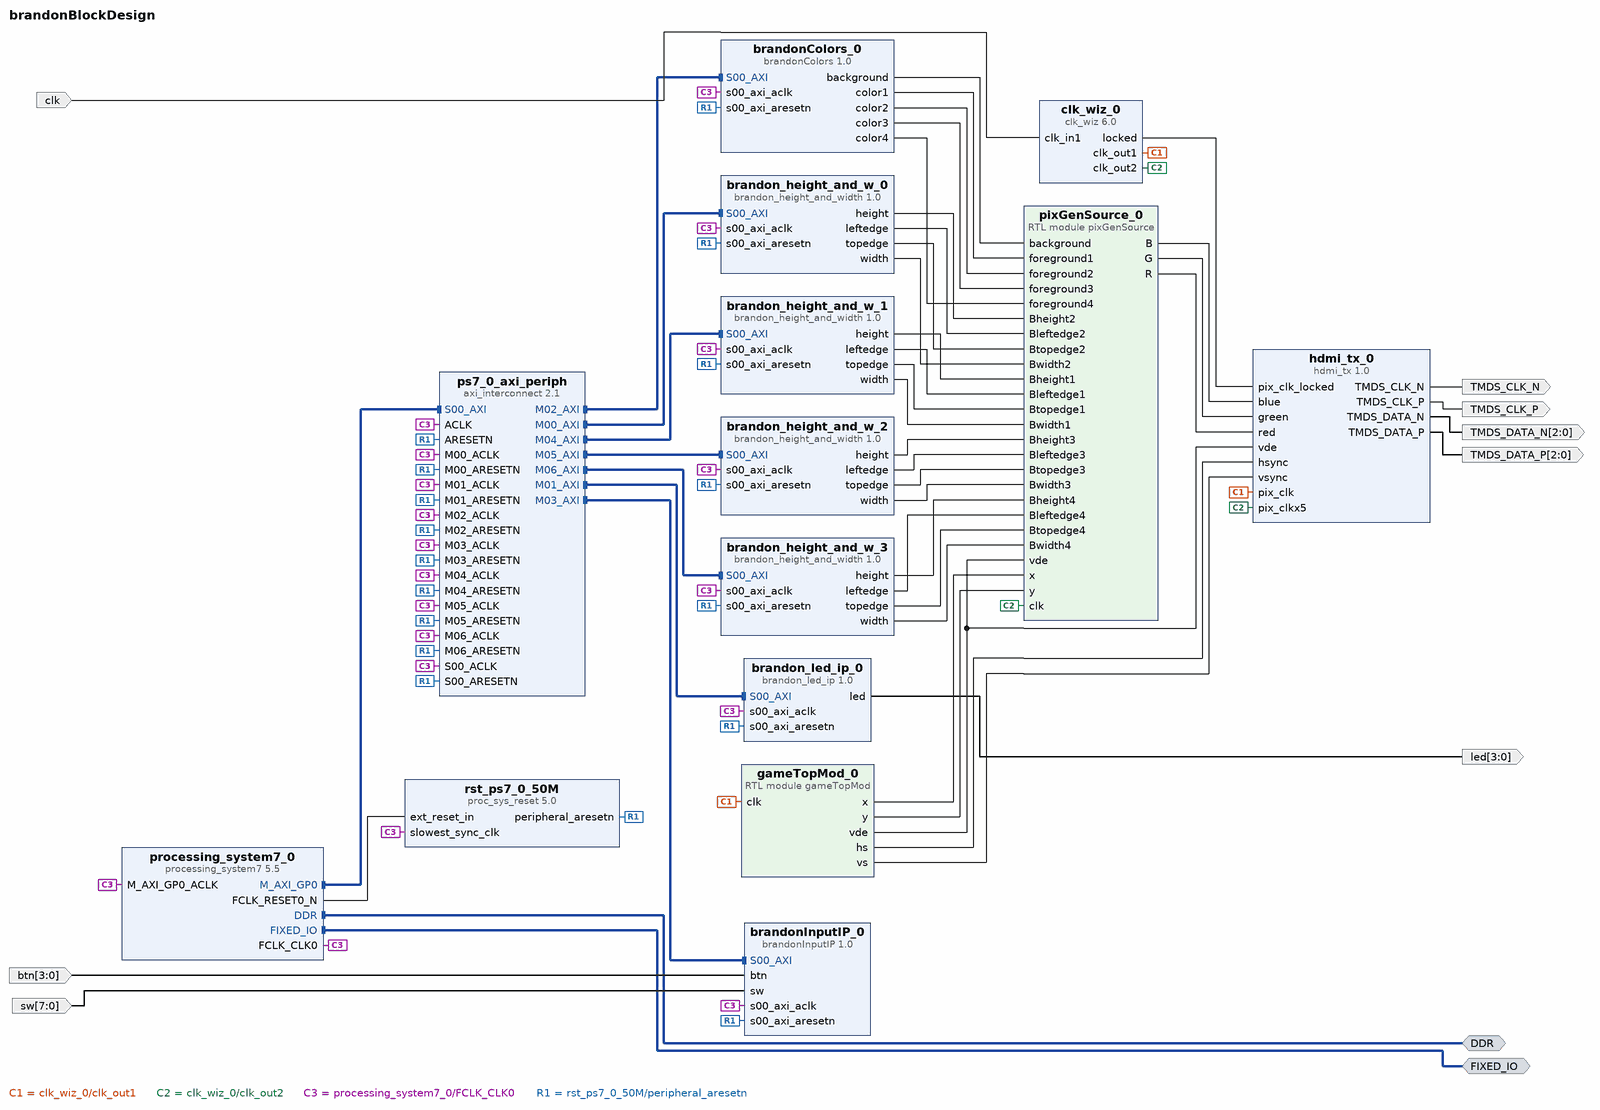
[diagram p0: block diagram of the top level]
# Vivado block design brandonBlockDesign, xc7z007sclg400-1, Vivado 2021.1
create_bd_design brandonBlockDesign

create_bd_intf_port -mode Master -vlnv xilinx.com:interface:ddrx_rtl:1.0 DDR
create_bd_intf_port -mode Master -vlnv xilinx.com:display_processing_system7:fixedio_rtl:1.0 FIXED_IO
create_bd_port -dir I -from 7 -to 0 sw
create_bd_port -dir I -from 3 -to 0 btn
create_bd_port -dir O -from 3 -to 0 led
create_bd_port -dir O -type clk TMDS_CLK_P
create_bd_port -dir O -from 2 -to 0 TMDS_DATA_N
create_bd_port -dir O -type clk TMDS_CLK_N
create_bd_port -dir O -from 2 -to 0 TMDS_DATA_P
create_bd_port -dir I -type clk clk

create_bd_cell -type ip -vlnv xilinx.com:ip:processing_system7:5.5 processing_system7_0
set_property -dict [list \
  CONFIG.PCW_FPGA0_PERIPHERAL_FREQMHZ 50 \
  CONFIG.PCW_GPIO_MIO_GPIO_ENABLE 1 \
  CONFIG.PCW_GPIO_MIO_GPIO_IO MIO \
  CONFIG.PCW_I2C_RESET_ENABLE 1 \
  CONFIG.PCW_QSPI_GRP_FBCLK_ENABLE 1 \
  CONFIG.PCW_QSPI_GRP_FBCLK_IO {MIO 8} \
  CONFIG.PCW_QSPI_GRP_SINGLE_SS_ENABLE 1 \
  CONFIG.PCW_QSPI_GRP_SINGLE_SS_IO {MIO 1 .. 6} \
  CONFIG.PCW_QSPI_PERIPHERAL_ENABLE 1 \
  CONFIG.PCW_QSPI_QSPI_IO {MIO 1 .. 6} \
  CONFIG.PCW_SD0_GRP_CD_ENABLE 1 \
  CONFIG.PCW_SD0_GRP_CD_IO {MIO 47} \
  CONFIG.PCW_SD0_GRP_WP_ENABLE 0 \
  CONFIG.PCW_SD0_PERIPHERAL_ENABLE 1 \
  CONFIG.PCW_SD0_SD0_IO {MIO 40 .. 45} \
  CONFIG.PCW_SDIO_PERIPHERAL_FREQMHZ 100 \
  CONFIG.PCW_SINGLE_QSPI_DATA_MODE x4 \
  CONFIG.PCW_SPI1_PERIPHERAL_ENABLE 1 \
  CONFIG.PCW_SPI1_SPI1_IO {MIO 10 .. 15} \
  CONFIG.PCW_UART0_PERIPHERAL_ENABLE 1 \
  CONFIG.PCW_UART0_UART0_IO {MIO 14 .. 15} \
  CONFIG.PCW_UART1_PERIPHERAL_ENABLE 0 \
  CONFIG.PCW_UART_PERIPHERAL_FREQMHZ 100 \
  CONFIG.PCW_UIPARAM_DDR_BUS_WIDTH {16 Bit} \
  CONFIG.PCW_UIPARAM_DDR_MEMORY_TYPE {DDR 3 (Low Voltage)} \
  CONFIG.PCW_UIPARAM_DDR_PARTNO Custom \
  CONFIG.PCW_USB0_PERIPHERAL_ENABLE 1 \
  CONFIG.PCW_USB0_RESET_ENABLE 1 \
  CONFIG.PCW_USB0_RESET_IO {MIO 46} \
  CONFIG.PCW_USB0_USB0_IO {MIO 28 .. 39} \
  CONFIG.PCW_USB_RESET_ENABLE 1 \
  CONFIG.PCW_USB_RESET_SELECT {Share reset pin} \
] [get_bd_cells processing_system7_0]
# 222 more settings of processing_system7_0 are not shown: defaults, MIO pin electricals, DDR timing, and values the tool derives
create_bd_cell -type ip -vlnv xilinx.com:user:brandon_led_ip:1.0 brandon_led_ip_0
create_bd_cell -type ip -vlnv xilinx.com:ip:proc_sys_reset:5.0 rst_ps7_0_50M
create_bd_cell -type ip -vlnv xilinx.com:user:brandonInputIP:1.0 brandonInputIP_0
create_bd_cell -type ip -vlnv realdigital.org:realdigital:hdmi_tx:1.0 hdmi_tx_0
create_bd_cell -type ip -vlnv xilinx.com:ip:clk_wiz:6.0 clk_wiz_0
set_property -dict [list \
  CONFIG.CLKOUT1_JITTER 337.616 \
  CONFIG.CLKOUT1_PHASE_ERROR 322.999 \
  CONFIG.CLKOUT1_REQUESTED_OUT_FREQ 74.25 \
  CONFIG.CLKOUT2_JITTER 258.703 \
  CONFIG.CLKOUT2_PHASE_ERROR 322.999 \
  CONFIG.CLKOUT2_REQUESTED_OUT_FREQ 371.25 \
  CONFIG.CLKOUT2_USED true \
  CONFIG.MMCM_CLKFBOUT_MULT_F 37.125 \
  CONFIG.MMCM_CLKOUT0_DIVIDE_F 10.000 \
  CONFIG.MMCM_CLKOUT1_DIVIDE 2 \
  CONFIG.MMCM_DIVCLK_DIVIDE 5 \
  CONFIG.NUM_OUT_CLKS 2 \
  CONFIG.USE_RESET false \
] [get_bd_cells clk_wiz_0]
create_bd_cell -type ip -vlnv xilinx.com:user:brandon_height_and_width:1.0 brandon_height_and_w_0
create_bd_cell -type ip -vlnv wsu.edu:user:brandonColors:1.0 brandonColors_0
create_bd_cell -type module -reference gameTopMod gameTopMod_0
create_bd_cell -type ip -vlnv xilinx.com:ip:axi_interconnect:2.1 ps7_0_axi_periph
set_property -dict {CONFIG.NUM_MI 7} [get_bd_cells ps7_0_axi_periph]
create_bd_cell -type ip -vlnv xilinx.com:user:brandon_height_and_width:1.0 brandon_height_and_w_1
create_bd_cell -type ip -vlnv xilinx.com:user:brandon_height_and_width:1.0 brandon_height_and_w_2
create_bd_cell -type ip -vlnv xilinx.com:user:brandon_height_and_width:1.0 brandon_height_and_w_3
create_bd_cell -type module -reference pixGenSource pixGenSource_0

# ---- connections ----

connect_bd_intf_net [get_bd_intf_ports DDR] [get_bd_intf_pins processing_system7_0/DDR]
connect_bd_intf_net [get_bd_intf_ports FIXED_IO] [get_bd_intf_pins processing_system7_0/FIXED_IO]
connect_bd_intf_net [get_bd_intf_pins processing_system7_0/M_AXI_GP0] [get_bd_intf_pins ps7_0_axi_periph/S00_AXI]
connect_bd_intf_net [get_bd_intf_pins ps7_0_axi_periph/M00_AXI] [get_bd_intf_pins brandon_height_and_w_0/S00_AXI]
connect_bd_intf_net [get_bd_intf_pins ps7_0_axi_periph/M01_AXI] [get_bd_intf_pins brandon_led_ip_0/S00_AXI]
connect_bd_intf_net [get_bd_intf_pins ps7_0_axi_periph/M02_AXI] [get_bd_intf_pins brandonColors_0/S00_AXI]
connect_bd_intf_net [get_bd_intf_pins ps7_0_axi_periph/M03_AXI] [get_bd_intf_pins brandonInputIP_0/S00_AXI]
connect_bd_intf_net [get_bd_intf_pins ps7_0_axi_periph/M04_AXI] [get_bd_intf_pins brandon_height_and_w_1/S00_AXI]
connect_bd_intf_net [get_bd_intf_pins ps7_0_axi_periph/M05_AXI] [get_bd_intf_pins brandon_height_and_w_2/S00_AXI]
connect_bd_intf_net [get_bd_intf_pins ps7_0_axi_periph/M06_AXI] [get_bd_intf_pins brandon_height_and_w_3/S00_AXI]
connect_bd_net [get_bd_pins brandonColors_0/background] [get_bd_pins pixGenSource_0/background]
connect_bd_net [get_bd_pins brandonColors_0/color1] [get_bd_pins pixGenSource_0/foreground1]
connect_bd_net [get_bd_pins brandonColors_0/color2] [get_bd_pins pixGenSource_0/foreground2]
connect_bd_net [get_bd_pins brandonColors_0/color3] [get_bd_pins pixGenSource_0/foreground3]
connect_bd_net [get_bd_pins brandonColors_0/color4] [get_bd_pins pixGenSource_0/foreground4]
connect_bd_net [get_bd_pins brandon_height_and_w_0/height] [get_bd_pins pixGenSource_0/Bheight2]
connect_bd_net [get_bd_pins brandon_height_and_w_0/leftedge] [get_bd_pins pixGenSource_0/Bleftedge2]
connect_bd_net [get_bd_pins brandon_height_and_w_0/topedge] [get_bd_pins pixGenSource_0/Btopedge2]
connect_bd_net [get_bd_pins brandon_height_and_w_0/width] [get_bd_pins pixGenSource_0/Bwidth2]
connect_bd_net [get_bd_pins brandon_height_and_w_1/height] [get_bd_pins pixGenSource_0/Bheight1]
connect_bd_net [get_bd_pins brandon_height_and_w_1/leftedge] [get_bd_pins pixGenSource_0/Bleftedge1]
connect_bd_net [get_bd_pins brandon_height_and_w_1/topedge] [get_bd_pins pixGenSource_0/Btopedge1]
connect_bd_net [get_bd_pins brandon_height_and_w_1/width] [get_bd_pins pixGenSource_0/Bwidth1]
connect_bd_net [get_bd_pins brandon_height_and_w_2/height] [get_bd_pins pixGenSource_0/Bheight3]
connect_bd_net [get_bd_pins brandon_height_and_w_2/leftedge] [get_bd_pins pixGenSource_0/Bleftedge3]
connect_bd_net [get_bd_pins brandon_height_and_w_2/topedge] [get_bd_pins pixGenSource_0/Btopedge3]
connect_bd_net [get_bd_pins brandon_height_and_w_2/width] [get_bd_pins pixGenSource_0/Bwidth3]
connect_bd_net [get_bd_pins brandon_height_and_w_3/height] [get_bd_pins pixGenSource_0/Bheight4]
connect_bd_net [get_bd_pins brandon_height_and_w_3/leftedge] [get_bd_pins pixGenSource_0/Bleftedge4]
connect_bd_net [get_bd_pins brandon_height_and_w_3/topedge] [get_bd_pins pixGenSource_0/Btopedge4]
connect_bd_net [get_bd_pins brandon_height_and_w_3/width] [get_bd_pins pixGenSource_0/Bwidth4]
connect_bd_net [get_bd_pins brandon_led_ip_0/led] [get_bd_ports led]
connect_bd_net -net btn_0_1 [get_bd_ports btn] [get_bd_pins brandonInputIP_0/btn]
connect_bd_net [get_bd_ports clk] [get_bd_pins clk_wiz_0/clk_in1]
connect_bd_net [get_bd_pins clk_wiz_0/clk_out1] [get_bd_pins hdmi_tx_0/pix_clk] [get_bd_pins gameTopMod_0/clk]
connect_bd_net [get_bd_pins clk_wiz_0/clk_out2] [get_bd_pins hdmi_tx_0/pix_clkx5] [get_bd_pins pixGenSource_0/clk]
connect_bd_net [get_bd_pins clk_wiz_0/locked] [get_bd_pins hdmi_tx_0/pix_clk_locked]
connect_bd_net [get_bd_pins gameTopMod_0/hs] [get_bd_pins hdmi_tx_0/hsync]
connect_bd_net [get_bd_pins gameTopMod_0/vde] [get_bd_pins pixGenSource_0/vde] [get_bd_pins hdmi_tx_0/vde]
connect_bd_net [get_bd_pins gameTopMod_0/vs] [get_bd_pins hdmi_tx_0/vsync]
connect_bd_net [get_bd_pins gameTopMod_0/x] [get_bd_pins pixGenSource_0/x]
connect_bd_net [get_bd_pins gameTopMod_0/y] [get_bd_pins pixGenSource_0/y]
connect_bd_net [get_bd_pins hdmi_tx_0/TMDS_CLK_N] [get_bd_ports TMDS_CLK_N]
connect_bd_net [get_bd_pins hdmi_tx_0/TMDS_CLK_P] [get_bd_ports TMDS_CLK_P]
connect_bd_net [get_bd_pins hdmi_tx_0/TMDS_DATA_N] [get_bd_ports TMDS_DATA_N]
connect_bd_net [get_bd_pins hdmi_tx_0/TMDS_DATA_P] [get_bd_ports TMDS_DATA_P]
connect_bd_net [get_bd_pins pixGenSource_0/B] [get_bd_pins hdmi_tx_0/blue]
connect_bd_net [get_bd_pins pixGenSource_0/G] [get_bd_pins hdmi_tx_0/green]
connect_bd_net [get_bd_pins pixGenSource_0/R] [get_bd_pins hdmi_tx_0/red]
connect_bd_net [get_bd_pins processing_system7_0/FCLK_CLK0] \
  [get_bd_pins brandon_height_and_w_0/s00_axi_aclk] [get_bd_pins brandon_led_ip_0/s00_axi_aclk] \
  [get_bd_pins brandonColors_0/s00_axi_aclk] [get_bd_pins brandonInputIP_0/s00_axi_aclk] \
  [get_bd_pins processing_system7_0/M_AXI_GP0_ACLK] [get_bd_pins rst_ps7_0_50M/slowest_sync_clk] \
  [get_bd_pins ps7_0_axi_periph/ACLK] [get_bd_pins ps7_0_axi_periph/S00_ACLK] [get_bd_pins ps7_0_axi_periph/M00_ACLK] \
  [get_bd_pins ps7_0_axi_periph/M01_ACLK] [get_bd_pins ps7_0_axi_periph/M02_ACLK] [get_bd_pins ps7_0_axi_periph/M03_ACLK] \
  [get_bd_pins brandon_height_and_w_1/s00_axi_aclk] [get_bd_pins ps7_0_axi_periph/M04_ACLK] \
  [get_bd_pins brandon_height_and_w_2/s00_axi_aclk] [get_bd_pins ps7_0_axi_periph/M05_ACLK] \
  [get_bd_pins brandon_height_and_w_3/s00_axi_aclk] [get_bd_pins ps7_0_axi_periph/M06_ACLK]
connect_bd_net [get_bd_pins processing_system7_0/FCLK_RESET0_N] [get_bd_pins rst_ps7_0_50M/ext_reset_in]
connect_bd_net [get_bd_pins rst_ps7_0_50M/peripheral_aresetn] \
  [get_bd_pins brandon_led_ip_0/s00_axi_aresetn] [get_bd_pins brandonInputIP_0/s00_axi_aresetn] \
  [get_bd_pins brandon_height_and_w_0/s00_axi_aresetn] [get_bd_pins brandonColors_0/s00_axi_aresetn] \
  [get_bd_pins ps7_0_axi_periph/S00_ARESETN] [get_bd_pins ps7_0_axi_periph/M00_ARESETN] \
  [get_bd_pins ps7_0_axi_periph/ARESETN] [get_bd_pins ps7_0_axi_periph/M01_ARESETN] \
  [get_bd_pins ps7_0_axi_periph/M02_ARESETN] [get_bd_pins ps7_0_axi_periph/M03_ARESETN] \
  [get_bd_pins brandon_height_and_w_1/s00_axi_aresetn] [get_bd_pins ps7_0_axi_periph/M04_ARESETN] \
  [get_bd_pins brandon_height_and_w_2/s00_axi_aresetn] [get_bd_pins ps7_0_axi_periph/M05_ARESETN] \
  [get_bd_pins brandon_height_and_w_3/s00_axi_aresetn] [get_bd_pins ps7_0_axi_periph/M06_ARESETN]
connect_bd_net -net sw_0_1 [get_bd_ports sw] [get_bd_pins brandonInputIP_0/sw]

# ---- address map ----
assign_bd_address -offset 0x43C00000 -range 64K -target_address_space [get_bd_addr_spaces processing_system7_0/Data] [get_bd_addr_segs brandon_height_and_w_0/S00_AXI/S00_AXI_reg]
assign_bd_address -offset 0x43C10000 -range 64K -target_address_space [get_bd_addr_spaces processing_system7_0/Data] [get_bd_addr_segs brandon_led_ip_0/S00_AXI/S00_AXI_reg]
assign_bd_address -offset 0x43C20000 -range 64K -target_address_space [get_bd_addr_spaces processing_system7_0/Data] [get_bd_addr_segs brandonInputIP_0/S00_AXI/S00_AXI_reg]
assign_bd_address -offset 0x43C30000 -range 64K -target_address_space [get_bd_addr_spaces processing_system7_0/Data] [get_bd_addr_segs brandonColors_0/S00_AXI/S00_AXI_reg]
assign_bd_address -offset 0x43C40000 -range 64K -target_address_space [get_bd_addr_spaces processing_system7_0/Data] [get_bd_addr_segs brandon_height_and_w_1/S00_AXI/S00_AXI_reg]
assign_bd_address -offset 0x43C50000 -range 64K -target_address_space [get_bd_addr_spaces processing_system7_0/Data] [get_bd_addr_segs brandon_height_and_w_2/S00_AXI/S00_AXI_reg]
assign_bd_address -offset 0x43C60000 -range 64K -target_address_space [get_bd_addr_spaces processing_system7_0/Data] [get_bd_addr_segs brandon_height_and_w_3/S00_AXI/S00_AXI_reg]

validate_bd_design
save_bd_design
